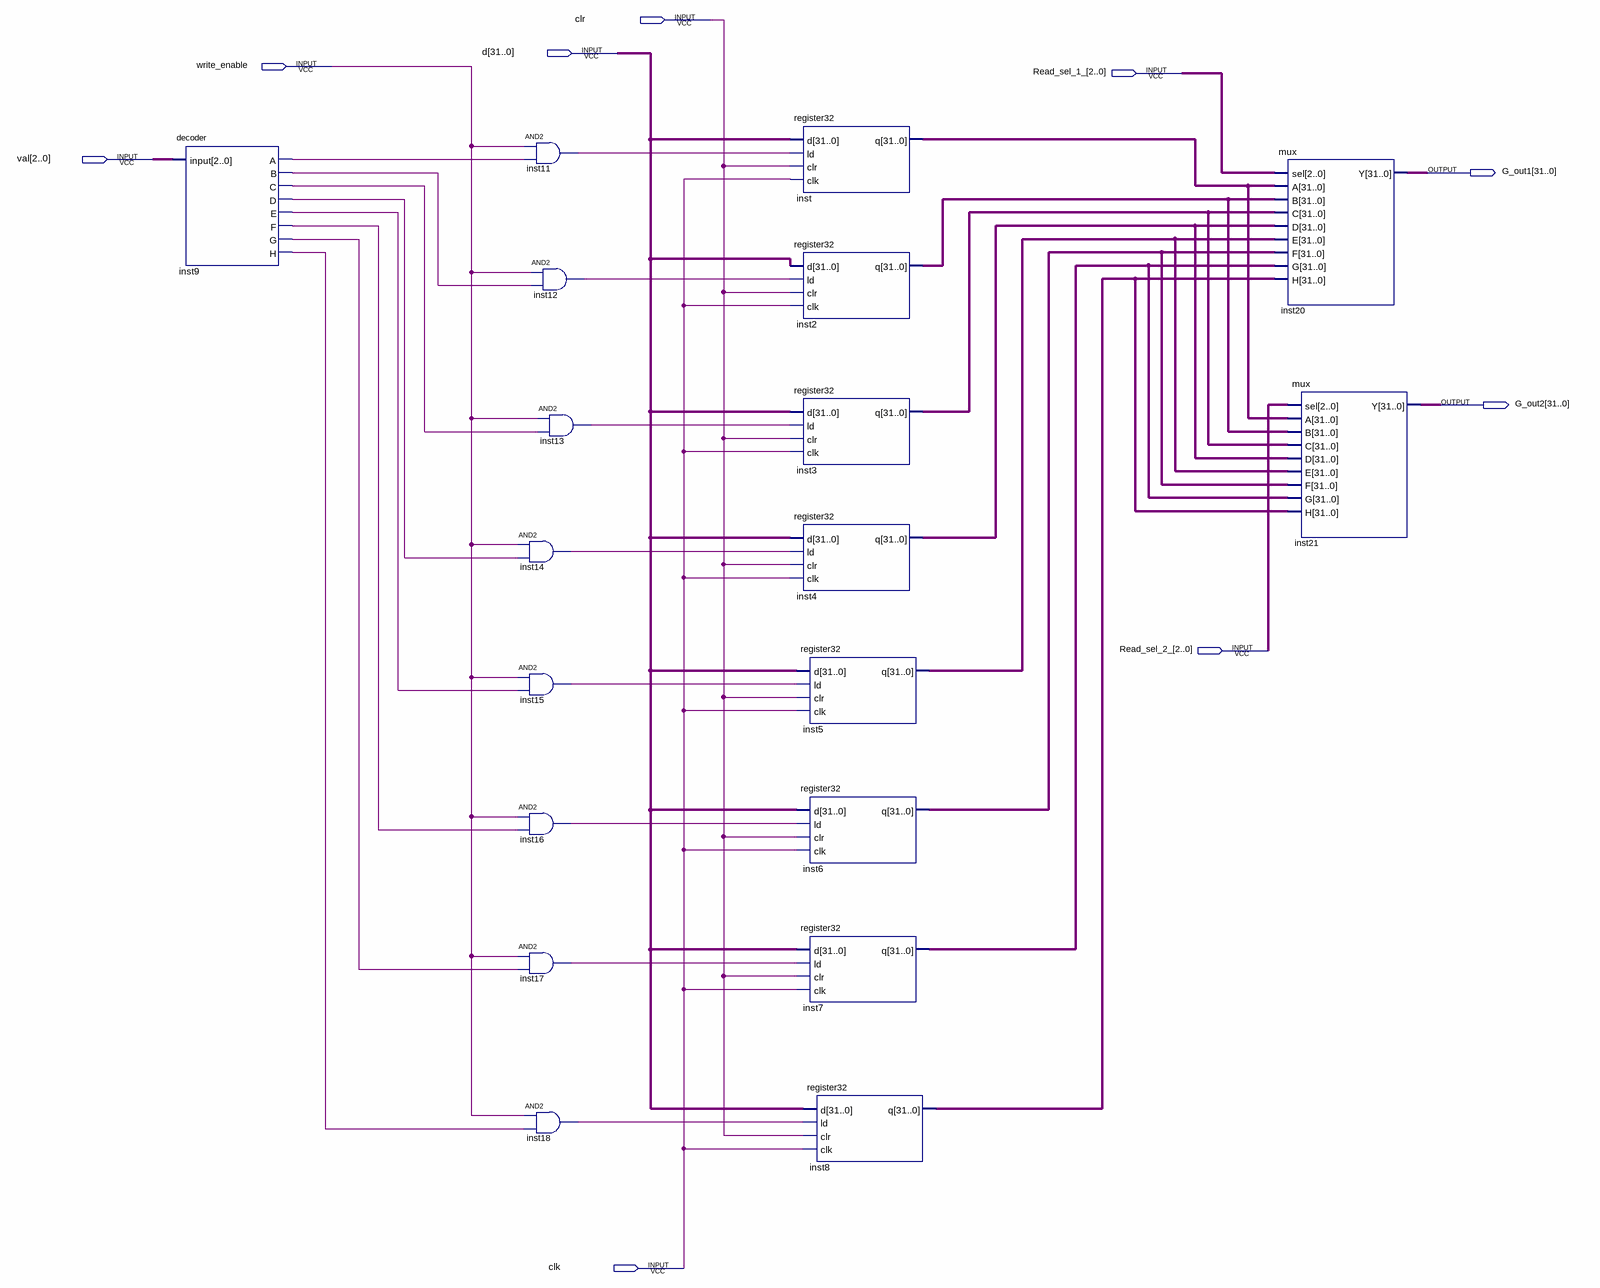
[diagram p0: schematic sheet]
// Quartus schematic final.bdf as structural Verilog: 19 symbols, 9 pins
module \final  (
  input  clr,
  input  [31:0] d,
  input  write_enable,
  input  [2:0] Read_sel_1_,
  input  [2:0] val,
  input  [2:0] Read_sel_2_,
  input  clk,
  output [31:0] G_out1,
  output [31:0] G_out2
);

  wire inst9_a, inst9_b, inst9_c, inst9_d, inst9_e, inst9_f, inst9_g, inst9_h, inst11_out, inst12_out,
       inst13_out, inst14_out, inst15_out, inst16_out, inst17_out, inst18_out;
  wire [31:0] inst2_q, inst3_q, inst4_q, inst5_q, inst6_q, inst7_q, inst8_q, inst_q;

  decoder inst9 (
    .\input (val), .A(inst9_a), .B(inst9_b), .C(inst9_c), .D(inst9_d), .E(inst9_e), .F(inst9_f), .G(inst9_g),
    .H(inst9_h));
  and inst11 (inst11_out, write_enable, inst9_a);
  and inst14 (inst14_out, write_enable, inst9_d);
  and inst15 (inst15_out, write_enable, inst9_e);
  and inst16 (inst16_out, write_enable, inst9_f);
  and inst17 (inst17_out, write_enable, inst9_g);
  and inst18 (inst18_out, write_enable, inst9_h);
  and inst12 (inst12_out, write_enable, inst9_b);
  and inst13 (inst13_out, write_enable, inst9_c);
  register32 inst (.d(d), .ld(inst11_out), .clr(clr), .clk(clk), .q(inst_q));
  register32 inst2 (.d(d), .ld(inst12_out), .clr(clr), .clk(clk), .q(inst2_q));
  register32 inst3 (.d(d), .ld(inst13_out), .clr(clr), .clk(clk), .q(inst3_q));
  register32 inst4 (.d(d), .ld(inst14_out), .clr(clr), .clk(clk), .q(inst4_q));
  register32 inst5 (.d(d), .ld(inst15_out), .clr(clr), .clk(clk), .q(inst5_q));
  register32 inst6 (.d(d), .ld(inst16_out), .clr(clr), .clk(clk), .q(inst6_q));
  register32 inst7 (.d(d), .ld(inst17_out), .clr(clr), .clk(clk), .q(inst7_q));
  register32 inst8 (.d(d), .ld(inst18_out), .clr(clr), .clk(clk), .q(inst8_q));
  mux inst20 (
    .sel(Read_sel_1_), .A(inst_q), .B(inst2_q), .C(inst3_q), .D(inst4_q), .E(inst5_q), .F(inst6_q),
    .G(inst7_q), .H(inst8_q), .Y(G_out1));
  mux inst21 (
    .sel(Read_sel_2_), .A(inst_q), .B(inst2_q), .C(inst3_q), .D(inst4_q), .E(inst5_q), .F(inst6_q),
    .G(inst7_q), .H(inst8_q), .Y(G_out2));
endmodule
